# Altium schematic sheet TPS54336ADDA.SchDoc
size A; SheetNumber: 2; SheetTotal: 3; SPICEModelCacheGCWZWCBQ: <root> / <DocumentId>GCWZWCBQ</DocumentId> / <CacheFrame Number="0"> / <Model Name="umk107bj105_a-t" Kind="CKT"> / <Text>* UMK107BJ105_A-T     SPICE MODEL  ( General Type ) / *-------------------------------------------------------------------------------------------------------- / * Model Generated by TAIYO YUDEN Corporation (http://www.ty-top.com) / * Version 1.0 / * TAIYO YUDEN Control No. 170508_130520 / * Copyright(c) 2012 TAIYO YUDEN CO.,LTD. All Rights Reserved. / *-------------------------------------------------------------------------------------------------------- / * / * Products Name : Multilayer Ceramic Capacitors / * / * Characteristics : / *     Capacitance : 1 uF , Rated Voltage : 50V , TCC : X5R / *     Case Size : 1.6 x 0.8 / 0.063 x 0.031 [mm/inch] , Thickness : 0.8 / 0.031 [mm/inch] / *     (Conditions: Temperature = 25 degC , DC Bias Current/Voltage = 0A / 0V) / * / * Frequency Range : 40Hz - 3GHz / * / * External Node Assignments : / * / *  1  o---| |---o  2 / * / *-------------------------------------------------------------------------------------------------------- / .SubCkt UMK107BJ105_A-T 1 2 / **************************** / C0 1 110 0.79929u / Cm 1 101 0.13681u / C1 101 102 0.26224u / Rc1 101 102 5.8806k / C2 102 103 0.057839u / Rc2 102 103 469.42 / C3 103 110 0.014568u / Rc3 103 110 14.853 / C2m 1 301 0.13283u / C21 301 302 1.2593u / Rc21 301 302 6.3079k / C22 302 303 1.1189u / Rc22 302 303 6.9405k / C23 303 304 1.1421u / Rc23 303 304 6.4848k / C24 304 305 0.36861u / Rc24 304 305 785 / C25 305 306 0.39327u / Rc25 305 306 637.41 / C26 306 307 0.27451u / Rc26 306 307 19.365 / C27 307 308 0.15295u / Rc27 307 308 23.239 / C28 308 309 0.17569u / Rc28 308 309 17.788 / C29 309 110 1420.6p / Rc29 309 110 1.9725 / Rp0 1 110 500Meg / L0 110 120 0.24088n / Lm 120 130 0.1369n / L1 120 121 0.1842n / RL1 121 130 0.29804 / L2 120 122 0.40657n / RL2 122 130 0.57395 / L3 120 123 0.85773n / RL3 123 130 0.82282 / CR 120 124 0.11463u / LR 124 125 0.25983n / RR 125 130 52.447m / CL 130 140 1.4637p / LL 130 140 0.23986n / RL 130 140 33.985 / Rs 140 2 6.8539m / **************************** / .ends UMK107BJ105_A-T</Text> / </Model> / </CacheFrame> / </root>
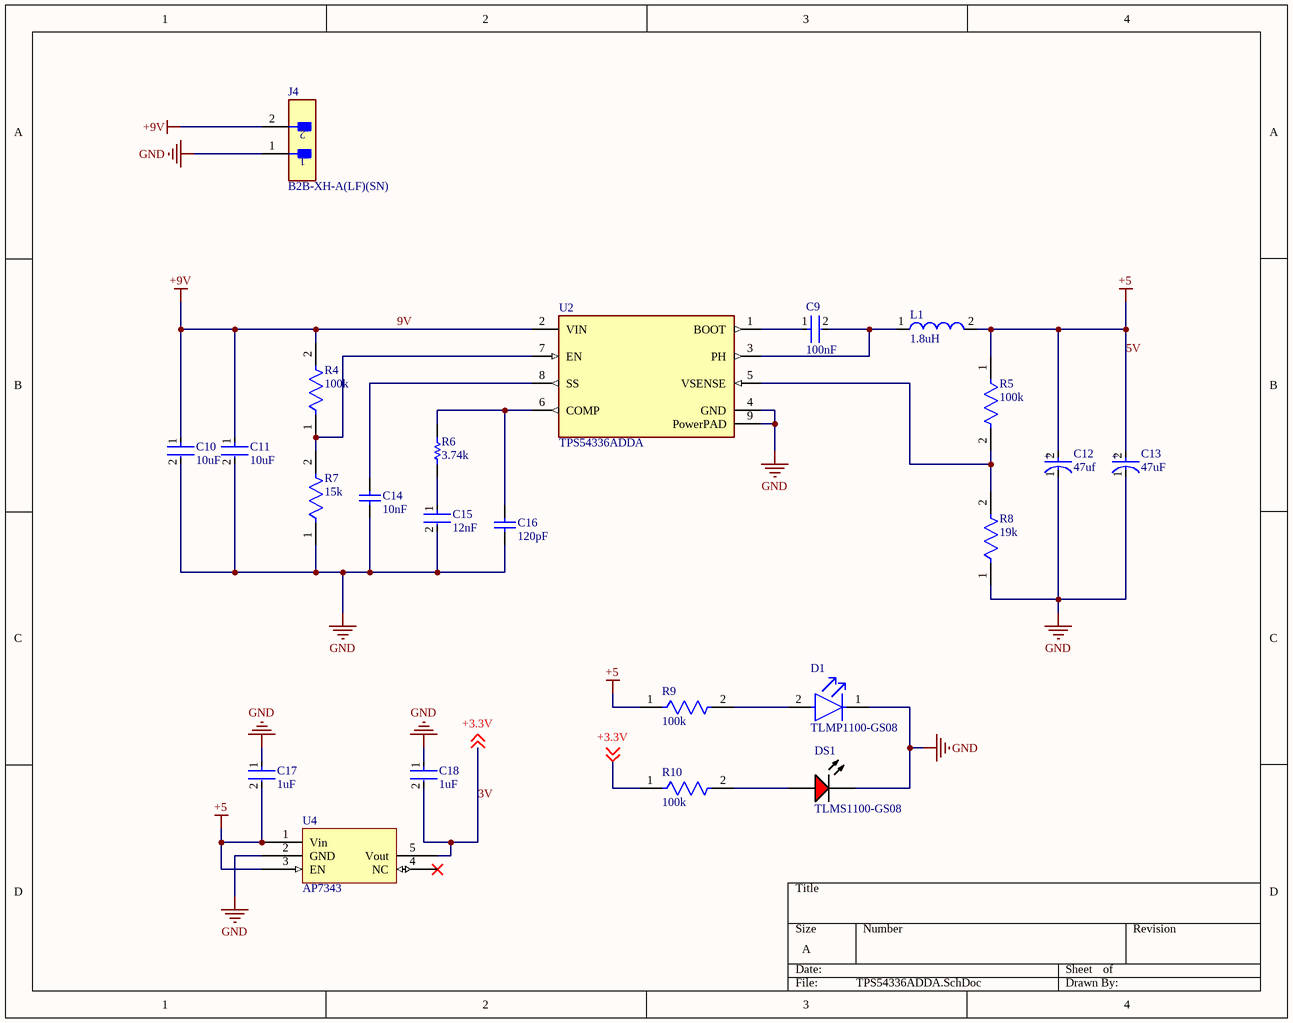
[diagram p0: TPS54336ADDA.SchDoc]

## Parts
C9  100nF  [FP-CGA3E-0_3-0_1-IPC_A]
C10  10uF  [FP-GRM188-0_2-MFG]
C11  10uF  [FP-GRM188-0_2-MFG]
C12  47uf  [FP-T491D476K025AT-MFG]
C13  47uF  [FP-T491D476K025AT-MFG]
C14  10nF  [CAPC1608X90X35ML10T15]
C15  12nF  [FP-C0603C-CF-MFG]
C16  120pF  [CAPC1608X87X35NL15T15]
C17  1uF  [FP-0603-L_1_6_0_1-W_0_8_0-IPC_B]
C18  1uF  [FP-0603-L_1_6_0_1-W_0_8_0-IPC_B]
D1  TLMP1100-GS08  [FP-6_541-5056_01-4-MFG]
DS1  TLMS1100-GS08  [VISH-TLMX1100_V]
J4  B2B-XH-A(LF)(SN)  [FP-B2B-XH-A_LF_SN-MFG]
L1  1.8uH  [WE-PDF-1045]
R4  100k  [FP-RC0603-0_55-MFG]
R5  100k  [FP-ERA3A-IPC_A]
R6  3.74k  [RESC1608X55X30ML15T15]
R7  15k  [FP-CRCW0603-e3-MFG]
R8  19k  [FP-CRCW0603-e3-IPC_A]
R9  100k  [FP-ERA3A-IPC_A]
R10  100k  [FP-ERA3A-IPC_A]
U2  TPS54336ADDA  [FP-DDA0008E-IPC_C]
U4  AP7343  [SOT95P245X110-5N]

## Nets
5V: C12.2(A) C13.2(A) C17.2 L1.2 R5.1 R9.1 U4.1(Vin) U4.3(EN)  [also labelled +5]
9V: C10.1 C11.1 J4.2 R4.2 U2.2(VIN)  [also labelled +9V]
GND: C10.2 C11.2 C12.1(C) C13.1(C) C14.1 C15.2 C16.1 C17.1 C18.1 D1.1(C) DS1.2(K) J4.1 R7.1 R8.1 U2.4(GND) U2.9(PowerPAD) U4.2(GND)
3V: C18.2 R10.1 U4.5(Vout) ; off-sheet +3.3V  [also labelled +3.3V]
NetC9_1: C9.1 U2.1(BOOT)
NetC9_2: C9.2 L1.1 U2.3(PH)
NetC14_2: C14.2 U2.8(SS)
NetC15_1: C15.1 R6.1
NetC16_2: C16.2 R6.2 U2.6(COMP)
NetD1_2: D1.2(A) R9.2
NetDS1_1: DS1.1(A) R10.2
NetR4_1: R4.1 R7.2 U2.7(EN)
NetR5_2: R5.2 R8.2 U2.5(VSENSE)

Not connected (* = marked no-connect by the designer): U4 4(NC)*

## Notes on the sheet
- (in symbol CMP-03017-000020-1) +

## Library data of the parts
C9 = CMP-2000-07546-2: Cap Ceramic 100nF 50V X7R 10% Pad SMD 0603 +125°C Automotive T/R; Weight: 7.1E-05oz; Composition: Ceramic; Max Operating Temperature: 125°C; Termination: SMD/SMT; Dielectric: X7R; Length: 1.6mm; Package Quantity: 1; REACH SVHC: No SVHC; Lead Free: Lead Free; Case Code (Metric): 1608; Min Operating Temperature: -55°C; Packaging: Tape and Reel; Tolerance: 10%; Voltage Rating: 50V; Case Code (Imperial): 0603; Capacitance: 100nF; Case/Package: 0603; Voltage Rating (DC): 50V; Depth: 0.8mm; Radiation Hardening: No; Ratings: AEC-Q200; Mount: Surface Mount; Voltage: 50V; Thickness: 0.035inch; Width: 0.8mm; Height: 0.8mm
C10 C11 = CMP-2006-02520-2: Chip Multilayer Ceramic Capacitors for General Purpose, 0603, 10uF, X5R, 15%, 20%, 25V; Tolerance: 20%; Resistor Type: Ceramic; Voltage: 25V; Max Operating Temperature: 85°C; Min Operating Temperature: -55°C; Capacitance: 10uF; Dielectric: X5R; Lead Free: Lead Free; REACH SVHC: No SVHC; Case/Package: 0603; Mount: Surface Mount; Voltage Rating (DC): 25V; Height: 0.8mm; Length: 1.6mm; Thickness: 0.031inch; Width: 0.031inch; Termination: SMD/SMT; Case Code (Imperial): 0603; Case Code (Metric): 1608; Package Quantity: 1; Packaging: Tape and Reel; Depth: 0.8mm; Voltage Rating: 25V; Weight: 0.000222oz; Number of Pins: 2
C12 C13 = CMP-03017-000020-1: CAP TANT 47UF 10% 25V 2917; Dielectric Material: Tantalum; Life (Hours): 2000Hour; Ripple Current: 463mA; Leakage Current: 11.8uA; Polarity: Polar; ESR (Equivalent Series Resistance): 700mR; Height - Seated (Max): 0.122inch; Package Quantity: 1; Max Operating Temperature: 125°C; Failure Rate: 0.001%; Height: 2.8mm; Voltage Rating (DC): 25V; Dissipation Factor: 10%; Mount: Surface Mount; Min Operating Temperature: -55°C; Packaging: Tape and Reel; Radiation Hardening: No; Case Code (Metric): 7343; Features: General Purpose; Voltage: 25V; Case/Package: 2917; Capacitance: 47uF; Case Code (Imperial): 2917; Tolerance: 10%; Number of Pins: 2; Weight: 0.023634oz; REACH SVHC: No SVHC; RoHS Compliant: Yes; Length: 7.3mm; Depth: 4.3mm; Lead Free: Lead Free; Width: 4.3mm; Voltage Rating: 25V; Termination: SMD/SMT
C14 = CMP-2100-03642-1: Chip Capacitor, 10 nF, +/- 10%, 50 V, -55 to 125 degC, 0603 (1608 Metric), RoHS, Tape and Reel; Manufacturer: Murata; Insulation Resistance: 10GR; Dielectric: X7R; Voltage Rating: 50V; Material: Ceramic; Package Quantity: 1; Lead Free: LeadFree; Case/Package: 0603; Termination: SMD/SMT; REACH SVHC: Unknown; Manufacturer URL: http://www.murata.com/; Datasheet URL: http://search.murata.co.jp/Ceramy/image/img/A01X/G101/ENG/GRM188R71H103KA01-01.pdf; Mount: SurfaceMount; Datasheet Version: 42401.0; Number of Pins: 2; Length: 1.6mm; Voltage: 50V; Depth: 0.8mm; Tolerance: 10%; Min Operating Temperature: -55degC; Voltage Rating (DC): 50V; Max Operating Temperature: 125degC; Package Description: 2-Pin Surface Mount Device, Body 1.6 x 0.8 mm; RoHSCompliant: True; Case Code (Imperial): 0603; Width: 0.031inch; Case Code (Metric): 1608; Height: 0.8mm; Package Reference: 0603; Packaging: TapeandReel; Thickness: 0.035inch; Capacitance: 10nF; Dielectric Material: Ceramic
C15 = CMP-2006-02245-2: CAP CER 0.012UF 50V 10% X7R 0603; Manufacturer: KEMET; Manufacturer Part Number: C0603C123K5RACTU; Value: 12,000 pF; Automotive Grade: Grade 1; Material: Ceramic; Tolerance: 0.1; Temperature Coefficient: 30ppm/°C; Category: Cap; Height: 0.87mm; Lead Free: Yes; Temperature: -55°C to +125°C; Device Class L2: Capacitors; RoHS: TRUE; Capacitance: 12,000 pF; Mouser Description: Multilayer Ceramic Capacitors MLCC - SMD/SMT 50volts 12000pF X7R 10%; Temperature Range Low: -55°C; Temperature Range High: +125°C; Temperature Characteristic: X7R; Device Class L1: Passive Components; Package: C0603C-CF; Voltage Rating: 50 V; Octopart: https://octopart.com/c0603c123k5ractu-kemet-9143719; Device Class L3: Ceramic Capacitors; ComponentLink2URL: https://api.kemet.com/component-edge/download/datasheet/C0603C100J5GACAUTO.pdf; Automotive: Yes; ComponentLink2Description: Datasheet; Digikey Description: CAP CER 0.012UF 50V 10% X7R 0603
C16 = CMP-2006-03074-1: Manufacturer: Kemet; Part Number: C0603C121J5GACTU
C17 C18 = CMP-2000-05447-3: None; Tolerance: 10%; Voltage Rating: 50V; Dielectric: X5R; Height: 0.8mm; Depth: 0.8mm; Number of Pins: 2; Length: 1.6mm; Thickness: 0.035inch; Contact Plating: Nickel; Radiation Hardening: No; Package Quantity: 1; Case/Package: 0603; Capacitance: 1uF; Halogen Free: Halogen Free; RoHS Compliant: Yes; Termination: SMD/SMT; Max Operating Temperature: 85°C; Min Operating Temperature: -55°C; Case Code (Metric): 1608; Construction: Flat; Voltage Rating (DC): 50V; Packaging: Tape and Reel; Series: M; Case Code (Imperial): 0603; Width: 0.031inch; Mount: Surface Mount
D1 = CMP-02520-000009-1: LED GREEN 0603 SMD; Manufacturer: Vishay; Max Junction Temp: +120°C; Automotive Grade: Grade 3; Reverse Voltage: 6V; Led Orientation: Top View; Forward Voltage: 2.1V; Luminous Intensity: 15mcd; Forward Current: 20mA; Colour: Pure green; Peak Emmision Wavelength: 562nm; Wavelength: 561nm; Viewing Angle: 160°; Power Dissipation: 90mW; Digikey Description: LED GREEN 0603 SMD; Package: 6.541-5056.01-4; Ambient Temperature Range High: +100°C; Height: 0.65mm; Device Class L1: Optoelectronics; Device Class L2: LEDs; Mouser Description: Standard LEDs - SMD Pure Green; Temperature Range High: +120°C; RoHS: TRUE; Ambient Temperature Range Low: -40°C; Temperature: to +120°C; Manufacturer Part Number: TLMP1100-GS08; ComponentLink2URL: http://www.vishay.com/docs/83173/tlmb1100.pdf; Lead Free: Yes; Octopart: https://octopart.com/tlmp1100-gs08-vishay-55433993; Automotive: Yes; Device Class L3: unset; ComponentLink2Description: Datasheet; Category: Diode
DS1 = CMP-1666-00027-1: LED, RED, 2.1 V, -40 to 100 degC, 2-Pin SMD (0603), RoHS, Tape and Reel; Type (Capacitors): C0G; Resistance: 100000000000 Ohm; Capacitance: 12 pF; Voltage Rating: 50 V; Tolerance: 5%; Min Operating Temperature: -55degC; REACH SVHC: No SVHC; ComponentLink2Description: Datasheet; ComponentLink1URL: http://www.vishay.com/; Width: 0.8 mm; Package Quantity: 4000; PackageReference: TLMX1100; ComponentLink2URL: http://www.vishay.com/docs/83173/tlmb1100.pdf; Case/Package: 0603; Case Code (Metric): 1608; Packaging: Tape and Reel; Pins: 2; ComponentLink1Description: Manufacturer URL; Max Operating Temperature: 125degC; Height: 0.8 mm; Length: 1.6 mm; Mount: Surface Mount; PackageDescription: 2-Pin Surface Mount Device, Body 1.6 x 0.8 mm; DatasheetVersion: Rev. 2.7, 03/2016; Case Code (Imperial): 0603; Voltage Rating (DC): 50 V; RoHSCompliant: True; Radiation Hardening: No
J4 = CMP-2000-05888-3: CONN HEADER VERT 2POS 2.5MM; Current Rating: 3A; Voltage Rating: 250V; Number of Contacts: 2; Contact Resistance: 20mR; Wire/Cable Gauge: 22AWG; Insulation Resistance: 1GR; Connector Type: Male Pin; Packaging: Bulk; Contact Material: Brass; Lead Free: Lead Free; Orientation: Straight; Contact Plating: Tin; Max Current Rating: 3A; Termination: Solder; Fastening Type: Detent; Depth: 5.75mm; Housing Material: Polyamide; REACH SVHC: No SVHC; Series: XH; Voltage Rating (AC): 250V; Number of Positions: 2; Color: Natural; Contact Type: Male Pin; Max Voltage Rating (DC): 250V; Pitch: 2.5mm; Lead Pitch: 2.5mm; Mount: Through Hole; Max Operating Temperature: 85°C; Length: 7.4mm; Max Voltage Rating (AC): 250V; Min Operating Temperature: -25°C; Number of Rows: 1; Housing Color: White
L1 = CMP-0227-00049-1: SMD Power Inductor WE-PDF, L = 1.80 µH; Inductance: 1.80 ÂµH; ComponentLink2Description: Datasheet; ComponentLink1URL: http://www.we-online.com; ComponentLink1Description: Manufacturer Link; ComponentLink2URL: http://www.we-online.de/katalog/media/pdf/7447797180.pdf; PackageVersion: 2009; PackageReference: WE-PDF-1045; PackageDescription: SMD Inductor, 2-Leads, Body 10.2 x 10.2 mm; DatasheetVersion: ver 2, Jul-2009
R4 = CMP-2100-03662-2: RES SMD 100K OHM 1% 1/10W 0603; Voltage Rating (DC): 50V; Resistance: 100kR; Max Power Dissipation: 100mW; Temperature Coefficient: 100ppm/°C; Working Voltage: 75V; Length: 1.6mm; Lead Free: Lead Free; Number of Terminations: 2; Packaging: Tape and Reel; Voltage Rating: 50V; Termination: SMD/SMT; Width: 0.8mm; Resistor Type: Thick Film; Resistance Tolerance: 1%; Features: Moisture Resistant; Height: 0.45mm; Construction: Rectangular; Case/Package: 0603; Military Standard: Not; Case Code (Imperial): 0603; Series: RC; Technology: THICK FILM; Depth: 0.8mm; RoHS Compliant: Yes; REACH SVHC: No SVHC; Min Operating Temperature: -55°C; Case Code (Metric): 1608; Max Operating Temperature: 155°C; Power Rating: 100mW; Number of Pins: 2; Tolerance: 1%
R5 R9 R10 = CMP-2000-00873-2: RES SMD 100K OHM 0.1% 1/10W 0603; Temperature Coefficient: 25ppm/°C; Voltage Rating: 75V; Max Power Dissipation: 100mW; Resistance: 1kR; Technology: METAL FILM; Number of Pins: 2; Packaging: Tape and Reel; Case Code (Imperial): 0603; Case Code (Metric): 1608; Min Operating Temperature: -55°C; REACH SVHC: No SVHC; Length: 1.6mm; Termination: SMD/SMT; Depth: 0.8mm; Resistance Tolerance: 0.1%; Number of Terminations: 2; Width: 0.8mm; Military Standard: Not; Tolerance: 0.1%; Package Quantity: 5000; Contact Plating: Tin; Height: 0.45mm; Construction: Rectangular; Case/Package: 0603; Max Operating Temperature: 155°C; Resistor Type: Thin Film; Series: ERA-3A; Size Code: 0603; RoHS Compliant: Yes; Mount: Surface Mount; Radiation Hardening: No; Power Rating: 100mW
R6 = CMP-2000-00466-1: Part Number: ERJ-3EKF3741V; Manufacturer: Panasonic
R7 = CMP-2000-02920-2: RES Thick Film, 15kΩ, 1%, 0.1W, 100ppm/°C, 0603; Resistance: 15kR; Voltage Rating: 75V; Power Rating: 100mW; Temperature Coefficient: 100ppm/°C; Mount: Surface Mount; Depth: 0.85mm; Min Operating Temperature: -55°C; Max Operating Temperature: 155°C; Contact Plating: Tin; Composition: Thick Film; Lead Free: Lead Free; Voltage Rating (DC): 75V; Termination: SMD/SMT; Packaging: Tape and Reel; Length: 1.55mm; Military Standard: Not; Weight: 7.1E-05oz; Width: 0.85mm; Package Quantity: 5000; Radiation Hardening: No; Height: 0.45mm; Case/Package: 0603; Case Code (Metric): 1608; Tolerance: 1%; Case Code (Imperial): 0603
R8 = CMP-2000-02958-2: RES Thick Film, 18kΩ, 1%, 0.1W, 100ppm/°C, 0603; Max Power Dissipation: 100mW; Working Voltage: 75V; Resistance: 18kR; Min Operating Temperature: -55°C; Package Quantity: 10; Height: 0.45mm; Width: 0.033inch; Depth: 0.85mm; Radiation Hardening: No; Lead Free: Lead Free; Number of Pins: 2; Composition: Thick Film; Case Code (Imperial): 0603; Temperature Coefficient: 100ppm/°C; Military Standard: Not; Features: Automotive AEC-Q200; Power Rating: 100mW; Number of Terminations: 2; Weight: 7.1E-05oz; Case/Package: 0603; Voltage Rating: 75V; Mount: Surface Mount; Termination: SMD/SMT; Voltage Rating (DC): 75V; Length: 1.55mm; Case Code (Metric): 1608; Tolerance: 1%; Packaging: Tape and Reel; Max Operating Temperature: 155°C; Contact Plating: Tin
U2 = CMP-04918-000301-1: IC REG BUCK ADJUSTABLE 3A 8SOPWR; Min Output Voltage: 800mV; Output Voltage: 25V; Min Input Voltage: 4.5V; Number of Outputs: 1; Max Input Voltage: 28V; Synchronous Rectifier: Yes; Quiescent Current: 600uA; Switching Frequency: 340kHz; Output Configuration: Positive; REACH SVHC: No SVHC; Number of Pins: 8; RoHS Compliant: Yes; Max Output Voltage: 25V; Lead Free: Lead Free; Output Type: Adjustable; Max Operating Temperature: 150°C; Mount: Surface Mount; Output Current: 3A; Min Operating Temperature: -40°C; Packaging: Cut Tape; Case/Package: SOIC
U4 = Component_2